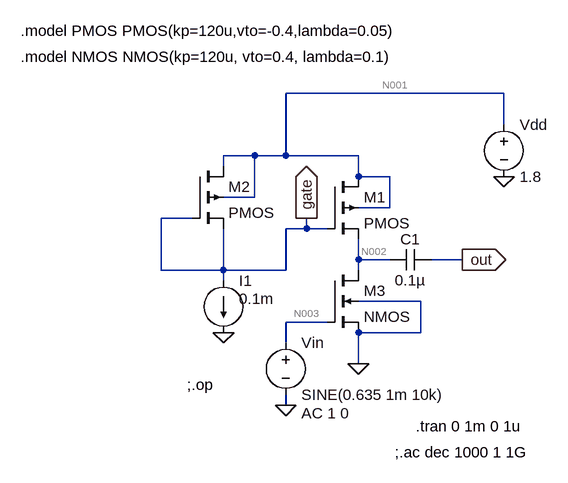
[diagram p0: schematic Draft1.asc]
Draft1.asc, the LTspice schematic file:
Version 4
SHEET 1 880 680
WIRE 560 -64 224 -64
WIRE 560 -16 560 -64
WIRE 176 32 128 32
WIRE 224 32 224 -64
WIRE 224 32 176 32
WIRE 336 32 224 32
WIRE 128 48 128 32
WIRE 336 64 336 32
WIRE 384 64 336 64
WIRE 176 96 176 32
WIRE 176 96 128 96
WIRE 384 112 384 64
WIRE 384 112 336 112
WIRE 80 128 32 128
WIRE 256 144 256 128
WIRE 256 144 224 144
WIRE 288 144 256 144
WIRE 336 192 336 160
WIRE 384 192 336 192
WIRE 496 192 448 192
WIRE 32 208 32 128
WIRE 128 208 128 144
WIRE 128 208 32 208
WIRE 224 208 224 144
WIRE 224 208 128 208
WIRE 336 208 336 192
WIRE 128 224 128 208
WIRE 432 256 336 256
WIRE 288 288 224 288
WIRE 432 304 432 256
WIRE 432 304 336 304
WIRE 224 320 224 288
WIRE 336 352 336 304
WIRE 224 416 224 400
FLAG 336 352 0
FLAG 128 304 0
FLAG 560 64 0
FLAG 256 128 gate
IOPIN 256 128 Out
FLAG 224 416 0
FLAG 496 192 out
IOPIN 496 192 Out
SYMBOL pmos4 288 64 R0
SYMATTR InstName M1
SYMATTR Value2 l=10u w=10u
SYMBOL current 128 224 R0
WINDOW 3 24 28 Left 2
WINDOW 123 0 0 Left 0
WINDOW 39 0 0 Left 0
SYMATTR Value 0.1m
SYMATTR InstName I1
SYMBOL voltage 224 304 R0
WINDOW 123 24 124 Left 2
WINDOW 39 0 0 Left 0
SYMATTR Value2 AC 1 0
SYMATTR InstName Vin
SYMATTR Value SINE(0.635 1m 10k)
SYMBOL voltage 560 -32 R0
WINDOW 123 0 0 Left 0
WINDOW 39 0 0 Left 0
SYMATTR InstName Vdd
SYMATTR Value 1.8
SYMBOL cap 448 176 R90
WINDOW 0 0 32 VBottom 2
WINDOW 3 32 32 VTop 2
SYMATTR InstName C1
SYMATTR Value 0.1µ
SYMBOL nmos4 288 208 R0
SYMATTR InstName M3
SYMATTR Value2 l=10u w=296u
SYMBOL pmos4 80 48 R0
SYMATTR InstName M2
SYMATTR Value2 l=10u w=10u
TEXT 72 384 Left 2 !;.op
TEXT 424 448 Left 2 !.tran 0 1m 0 1u
TEXT 392 488 Left 2 !;.ac dec 1000 1 1G
TEXT -184 -120 Left 2 !.model NMOS NMOS(kp=120u, vto=0.4, lambda=0.1)
TEXT -184 -160 Left 2 !.model PMOS PMOS(kp=120u,vto=-0.4,lambda=0.05)

The netlist it stands for:
* Draft1.asc
M1 N001 gate N002 N001 PMOS l=10u w=10u
I1 gate 0 0.1m
Vin N003 0 SINE(0.635 1m 10k) AC 1 0
Vdd N001 0 1.8
C1 out N002 0.1µ
M3 N002 N003 0 0 NMOS l=10u w=296u
M2 N001 gate gate N001 PMOS l=10u w=10u
.model NMOS NMOS
.model PMOS PMOS
.lib standard.mos
;.op
.tran 0 1m 0 1u
;.ac dec 1000 1 1G
.model NMOS NMOS(kp=120u, vto=0.4, lambda=0.1)
.model PMOS PMOS(kp=120u,vto=-0.4,lambda=0.05)
.backanno
.end

* Results of the author's LTspice run, read from the files saved beside the schematic
* Operating Point, zero values left out:
*   V(n001) = 1.8 V
*   V(gate) = 158.9 mV
*   V(n002) = 218.4 mV
*   V(n003) = 635 mV
*   V(out) = 21.84 nV
*   Id(M3) = 99.72 µA
*   Is(M3) = -99.72 µA
*   Id(M2) = 100 µA
*   Ib(M2) = 1.651 pA
*   Is(M2) = -100 µA
*   Id(M1) = 99.72 µA
*   Ib(M1) = 1.592 pA
*   Is(M1) = -99.72 µA
*   I(I1) = 100 µA
*   I(Vdd) = -199.7 µA
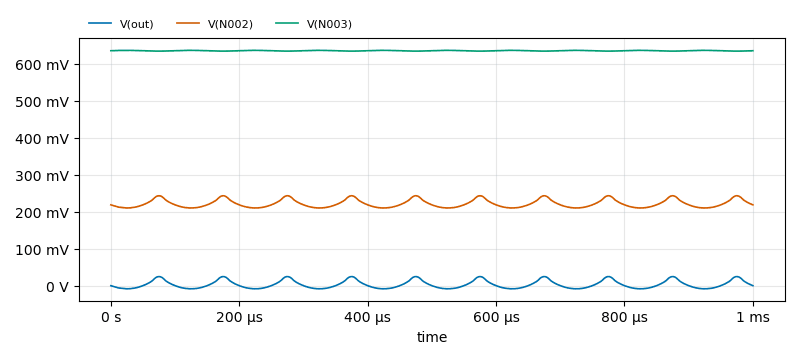
[diagram p1: Transient Analysis of Draft1.asc, plotted from the saved traces]
* Transient Analysis, 1 run:
*   V(out): min -8.472 mV, max 24.6 mV, average 3.207 mV, rms 11.14 mV, last 154.4 nV
*   V(N002): min 210 mV, max 243.1 mV, average 221.7 mV, rms 221.9 mV, last 218.4 mV
*   V(N003): min 634 mV, max 636 mV, average 635 mV, rms 635 mV, last 635 mV